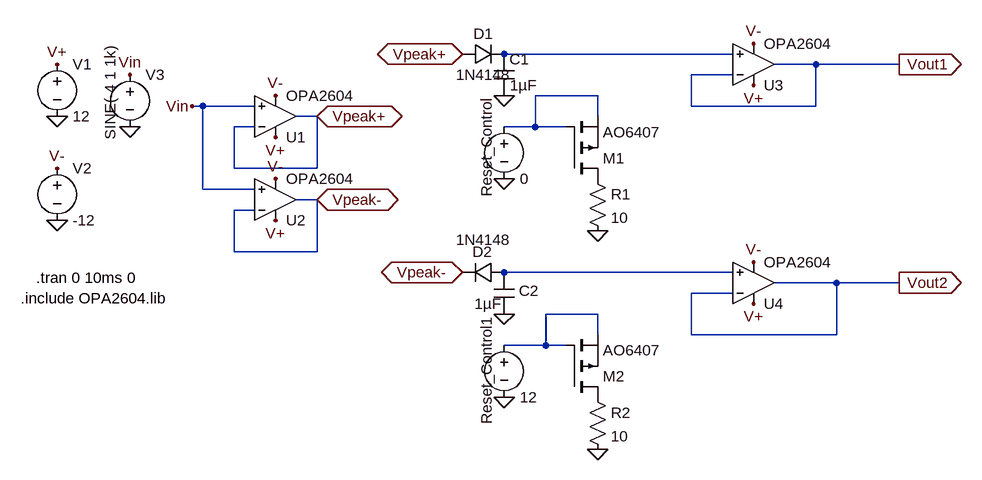
[diagram p0: schematic FunctionGeneratorPeakDetectorCkt.asc]
FunctionGeneratorPeakDetectorCkt.asc, the LTspice schematic file:
Version 4
SHEET 1 1408 680
WIRE 960 16 608 16
WIRE 1088 32 1024 32
WIRE 1216 32 1088 32
WIRE 960 48 896 48
WIRE 752 80 656 80
WIRE 144 96 128 96
WIRE 224 96 144 96
WIRE 896 96 896 48
WIRE 1088 96 1088 32
WIRE 1088 96 896 96
WIRE 320 112 288 112
WIRE 752 112 752 80
WIRE 224 128 192 128
WIRE 656 128 656 80
WIRE 656 128 608 128
WIRE 704 128 656 128
WIRE 192 192 192 128
WIRE 320 192 320 112
WIRE 320 192 192 192
WIRE 144 224 144 96
WIRE 224 224 144 224
WIRE 320 240 288 240
WIRE 224 256 192 256
WIRE 192 320 192 256
WIRE 320 320 320 240
WIRE 320 320 192 320
WIRE 960 352 608 352
WIRE 1120 368 1024 368
WIRE 1216 368 1120 368
WIRE 960 384 896 384
WIRE 752 416 672 416
WIRE 752 448 752 416
WIRE 896 448 896 384
WIRE 1120 448 1120 368
WIRE 1120 448 896 448
WIRE 672 464 672 416
WIRE 672 464 608 464
WIRE 704 464 672 464
FLAG -80 32 V+
FLAG -80 192 V-
FLAG -80 112 0
FLAG -80 272 0
FLAG 256 144 V+
FLAG 256 80 V-
FLAG 32 48 Vin
FLAG 32 128 0
FLAG 128 96 Vin
FLAG 320 112 Vpeak+
IOPIN 320 112 BiDir
FLAG 320 240 Vpeak-
IOPIN 320 240 BiDir
FLAG 256 208 V-
FLAG 256 272 V+
FLAG 544 16 Vpeak+
IOPIN 544 16 BiDir
FLAG 608 80 0
FLAG 1216 32 Vout1
IOPIN 1216 32 Out
FLAG 752 288 0
FLAG 608 208 0
FLAG 544 352 Vpeak-
IOPIN 544 352 BiDir
FLAG 608 416 0
FLAG 1216 368 Vout2
IOPIN 1216 368 Out
FLAG 752 624 0
FLAG 608 544 0
FLAG 992 64 V+
FLAG 992 400 V+
FLAG 992 336 V-
FLAG 992 0 V-
SYMBOL OpAmps\\opamp2 256 176 M180
SYMATTR InstName U1
SYMATTR Value OPA2604
SYMBOL voltage -80 16 R0
SYMATTR InstName V1
SYMATTR Value 12
SYMBOL voltage -80 176 R0
SYMATTR InstName V2
SYMATTR Value -12
SYMBOL voltage 32 32 R0
WINDOW 3 -30 -30 VRight 2
WINDOW 123 0 0 Left 0
WINDOW 39 0 0 Left 0
SYMATTR InstName V3
SYMATTR Value SINE(-4 1 1k)
SYMBOL OpAmps\\opamp2 256 304 M180
SYMATTR InstName U2
SYMATTR Value OPA2604
SYMBOL diode 544 32 R270
WINDOW 0 32 32 VTop 2
WINDOW 3 0 32 VBottom 2
SYMATTR InstName D1
SYMATTR Value 1N4148
SYMBOL cap 592 16 R0
WINDOW 3 25 48 Left 2
SYMATTR InstName C1
SYMATTR Value 1µF
SYMBOL pmos 704 208 M180
SYMATTR InstName M1
SYMATTR Value AO6407
SYMBOL res 736 192 R0
SYMATTR InstName R1
SYMATTR Value 10
SYMBOL voltage 608 112 R0
WINDOW 0 -27 -30 VRight 2
SYMATTR InstName Reset_Control
SYMATTR Value 0
SYMBOL diode 608 336 R90
WINDOW 0 0 33 VBottom 2
WINDOW 3 -50 32 VTop 2
SYMATTR InstName D2
SYMATTR Value 1N4148
SYMBOL cap 592 352 R0
WINDOW 0 39 28 Left 2
WINDOW 3 -30 48 Left 2
SYMATTR InstName C2
SYMATTR Value 1µF
SYMBOL pmos 704 544 M180
SYMATTR InstName M2
SYMATTR Value AO6407
SYMBOL res 736 528 R0
SYMATTR InstName R2
SYMATTR Value 10
SYMBOL voltage 608 448 R0
WINDOW 0 -27 -30 VRight 2
WINDOW 123 0 0 Left 0
WINDOW 39 0 0 Left 0
SYMATTR InstName Reset_Control1
SYMATTR Value 12
SYMBOL OpAmps\\opamp2 992 96 M180
SYMATTR InstName U3
SYMATTR Value OPA2604
SYMBOL OpAmps\\opamp2 992 432 M180
SYMATTR InstName U4
SYMATTR Value OPA2604
TEXT -136 392 Left 2 !.include OPA2604.lib
TEXT -112 360 Left 2 !.tran 0 10ms 0

The netlist it stands for:
* FunctionGeneratorPeakDetectorCkt.asc
XU1 Vin Vpeak+ V+ V- Vpeak+ OPA2604  ; pins In+ In- V+ V- OUT
V1 V+ 0 12
V2 V- 0 -12
V3 Vin 0 SINE(-4 1 1k)
XU2 Vin Vpeak- V+ V- Vpeak- OPA2604  ; pins In+ In- V+ V- OUT
D1 Vpeak+ N001 1N4148
C1 N001 0 1µF
M1 P001 N002 N002 N002 AO6407
R1 P001 0 10
V§Reset_Control N002 0 0
D2 N003 Vpeak- 1N4148
C2 N003 0 1µF
M2 P002 N004 N004 N004 AO6407
R2 P002 0 10
V§Reset_Control1 N004 0 12
XU3 N001 Vout1 V+ V- Vout1 OPA2604  ; pins In+ In- V+ V- OUT
XU4 N003 Vout2 V+ V- Vout2 OPA2604  ; pins In+ In- V+ V- OUT
.model D D
.lib standard.dio
.model NMOS NMOS
.model PMOS PMOS
.lib standard.mos
.include OPA2604.lib
.tran 0 10ms 0
.backanno
.end